# Altium schematic sheet 001_NUCLEO.SchDoc
size A4; SheetNumber: 2; SheetTotal: 3; SPICEModelCacheIXEBBHUF: <root> / <DocumentId>IXEBBHUF</DocumentId> / <CacheFrame Number="0"> / <Model Name="0603_150060rs75003" Kind="CKT"> / <Text>****** / .subckt 0603_150060RS75003  1  2 / D1 1 2 SMCW / .MODEL SMCW D / + IS=1.0025E-15 / + N=2.2259 / + RS=.3926 / + IKF=240.91E-6 / + CJO=1.0000E-12 / + M=.3333 / + VJ=.75 / + BV=5 / + IBV=10.00E-6 / + TT=5.0000E-9 / .ends</Text> / </Model> / </CacheFrame> / </root>
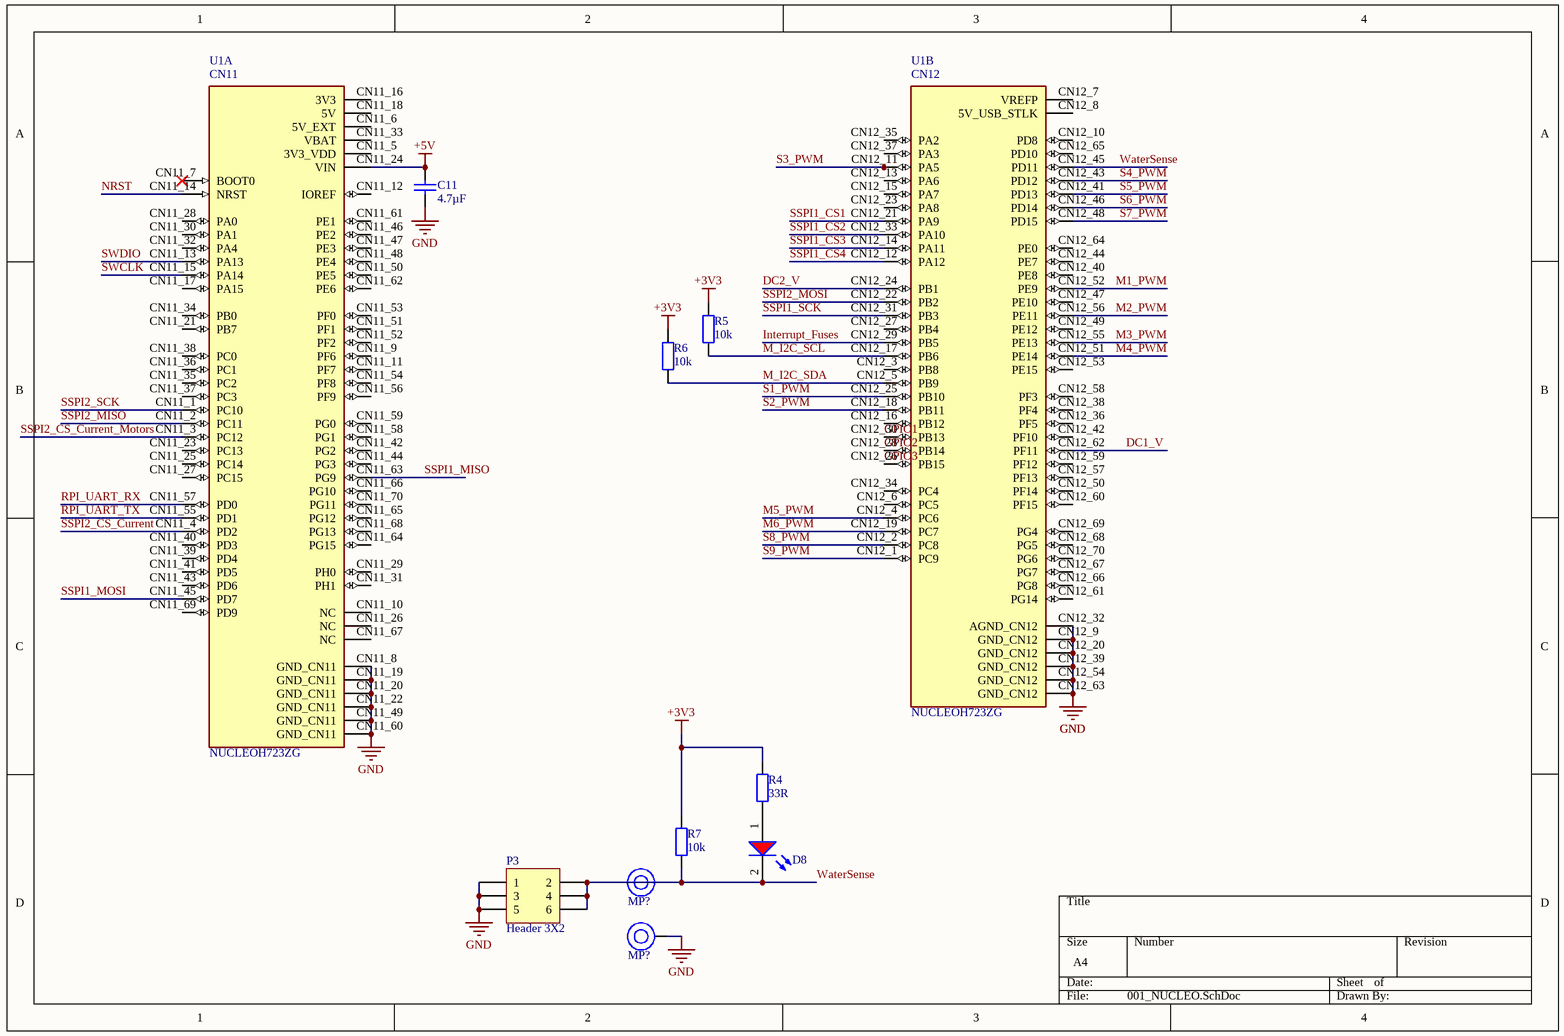
[diagram p0: 001_NUCLEO.SchDoc]

## Parts
(Parts that share a designator on the sheet are numbered #1, #2 ... from top to bottom, then left to right.)
C11  4.7µF  [WCAP-CSGP_1210_L3.2W2.5H2.5]
D8  Red, 2V, 140°  [WL-SMCW_0603_150060xx75003]  (value not drawn)
MP?#1  M3 x 3.6mm  [9775036360]  (value not drawn)  (graphical)
MP?#2  M3 x 3.6mm  [9775036360]  (value not drawn)  (graphical)
P3  Header 3X2  [HDR2X3]
R4  33R  [6-0805_M]
R5  10k  [6-0805_M]
R6  10k  [6-0805_M]
R7  10k  [6-0805_M]
U1  NUCLEOH723ZG  [MODULE_NUCLEOH723ZG]  (parts A,B of 10)

## Nets
+3V3: R4.2 R5.2 R6.2 R7.2
+5V: C11.2 U1.CN11_24(VIN)
GND: C11.1 MP?#2.1 P3.1 P3.3 P3.5 U1.CN11_8(GND_CN11) U1.CN11_19(GND_CN11) U1.CN11_20(GND_CN11) U1.CN11_22(GND_CN11) U1.CN11_49(GND_CN11) U1.CN11_60(GND_CN11) U1.CN12_9(GND_CN12) U1.CN12_20(GND_CN12) U1.CN12_32(AGND_CN12) U1.CN12_39(GND_CN12) U1.CN12_54(GND_CN12) U1.CN12_63(GND_CN12)
DC1_V: U1.CN12_62(PF11)
DC2_V: U1.CN12_24(PB1)
GPIO1: U1.CN12_30(PB13)
GPIO2: U1.CN12_28(PB14)
GPIO3: U1.CN12_26(PB15)
Interrupt_Fuses: U1.CN12_29(PB5)
M1_PWM: U1.CN12_52(PE9)
M2_PWM: U1.CN12_56(PE11)
M3_PWM: U1.CN12_55(PE13)
M4_PWM: U1.CN12_51(PE14)
M5_PWM: U1.CN12_4(PC6)
M6_PWM: U1.CN12_19(PC7)
M_I2C_SCL: R5.1 U1.CN12_17(PB6)
M_I2C_SDA: R6.1 U1.CN12_5(PB9)
NRST: U1.CN11_14(NRST)
RPI_UART_RX: U1.CN11_57(PD0)
RPI_UART_TX: U1.CN11_55(PD1)
S1_PWM: U1.CN12_25(PB10)
S2_PWM: U1.CN12_18(PB11)
S3_PWM: U1.CN12_11(PA5)
S4_PWM: U1.CN12_43(PD12)
S5_PWM: U1.CN12_41(PD13)
S6_PWM: U1.CN12_46(PD14)
S7_PWM: U1.CN12_48(PD15)
S8_PWM: U1.CN12_2(PC8)
S9_PWM: U1.CN12_1(PC9)
SSPI1_CS1: U1.CN12_21(PA9)
SSPI1_CS2: U1.CN12_33(PA10)
SSPI1_CS3: U1.CN12_14(PA11)
SSPI1_CS4: U1.CN12_12(PA12)
SSPI1_MISO: U1.CN11_63(PG9)
SSPI1_MOSI: U1.CN11_45(PD7)
SSPI1_SCK: U1.CN12_31(PB3)
SSPI2_CS_Current: U1.CN11_4(PD2)
SSPI2_CS_Current_Motors: U1.CN11_3(PC12)
SSPI2_MISO: U1.CN11_2(PC11)
SSPI2_MOSI: U1.CN12_22(PB2)
SSPI2_SCK: U1.CN11_1(PC10)
SWCLK: U1.CN11_15(PA14)
SWDIO: U1.CN11_13(PA13)
WaterSense: D8.2(K) MP?#1.1 P3.2 P3.4 P3.6 R7.1 U1.CN12_45(PD11)
NetD8_1: D8.1(A) R4.1

Not connected (* = marked no-connect by the designer): U1 CN11_5(3V3_VDD) CN11_6(5V_EXT) CN11_7(BOOT0)* CN11_9(PF6) CN11_10(NC) CN11_11(PF7) CN11_12(IOREF) CN11_16(3V3) CN11_17(PA15) CN11_18(5V) CN11_21(PB7) CN11_23(PC13) CN11_25(PC14) CN11_26(NC) CN11_27(PC15) CN11_28(PA0) CN11_29(PH0) CN11_30(PA1) CN11_31(PH1) CN11_32(PA4) CN11_33(VBAT) CN11_34(PB0) CN11_35(PC2) CN11_36(PC1) CN11_37(PC3) CN11_38(PC0) CN11_39(PD4) CN11_40(PD3) CN11_41(PD5) CN11_42(PG2) CN11_43(PD6) CN11_44(PG3) CN11_46(PE2) CN11_47(PE3) CN11_48(PE4) CN11_50(PE5) CN11_51(PF1) CN11_52(PF2) CN11_53(PF0) CN11_54(PF8) CN11_56(PF9) CN11_58(PG1) CN11_59(PG0) CN11_61(PE1) CN11_62(PE6) CN11_64(PG15) CN11_65(PG12) CN11_66(PG10) CN11_67(NC) CN11_68(PG13) CN11_69(PD9) CN11_70(PG11) CN12_3(PB8) CN12_6(PC5) CN12_7(VREFP) CN12_8(5V_USB_STLK) CN12_10(PD8) CN12_13(PA6) CN12_15(PA7) CN12_16(PB12) CN12_23(PA8) CN12_27(PB4) CN12_34(PC4) CN12_35(PA2) CN12_36(PF5) CN12_37(PA3) CN12_38(PF4) CN12_40(PE8) CN12_42(PF10) CN12_44(PE7) CN12_47(PE10) CN12_49(PE12) CN12_50(PF14) CN12_53(PE15) CN12_57(PF13) CN12_58(PF3) CN12_59(PF12) CN12_60(PF15) CN12_61(PG14) CN12_64(PE0) CN12_65(PD10) CN12_66(PG8) CN12_67(PG7) CN12_68(PG5) CN12_69(PG4) CN12_70(PG6)

## Notes on the sheet
- (in symbol NUCLEOH723ZG, part A) CN11
- (in symbol NUCLEOH723ZG, part B) CN12

## Library data of the parts
C11 = 885012209048: WCAP-CSGP Multilayer Ceramic Chip Capacitor, General Purpose, size 1210, X7R, 4.7µF, 50VDC; Manufacturer: Wurth Elektronik; Case/Size Code: 1210; Capacitance Tolerance: +/-10%; Dissipation Factor: 5%; Insulation Resistance: 0.02GΩ; Rated Voltage (DC): 50V; Technical Reference: X7R1210475K050DFCT10000; Manufacturer Part Number: 885012209048; Category: Multilayer Ceramic Chip Capacitors; Match Code: WCAP-CSGP; ComponentLink1Description: Website Link; ComponentLink1URL: https://www.we-online.com/redexpert/article/885012209048?ad; ComponentLink2Description: Datasheet Link; ComponentLink2URL: https://www.we-online.com/redexpert/spec/885012209048?ad; Mount: Surface Mount; Operating Temperature Max: 125°C; Operating Temperature Min: -55°C; Packaging: Tape and Reel; Length: 3.2mm; Width: 2.5mm; Height: 2.5mm; Capacitance: 4.7µF; Ceramic Type: X7R
D8 = 150060RS75003: WL-SMCW Mono-color Chip LED Waterclear, size 0603, Red, 2V, 140°; Manufacturer: Wurth Elektronik; Case/Size Code: 0603; Chip Technology: AlInGaP; Dominant Wavelength: 625nm; Luminous Intensity: 530mcd; Peak Wavelength: 630nm; Manufacturer Part Number: 150060RS75003; Category: Signal LEDs; Match Code: WL-SMCW; ComponentLink1Description: Website Link; ComponentLink1URL: https://www.we-online.com/redexpert/article/150060RS75003?ad; ComponentLink2Description: Datasheet Link; ComponentLink2URL: https://www.we-online.com/redexpert/spec/150060RS75003?ad; Mount: Surface Mount; Operating Temperature Max: 100°C; Operating Temperature Min: -40°C; Packaging: Tape and Reel; Length: 1.6mm; Width: 0.8mm; Height: 0.7mm; Emitting Color: Red; Forward Voltage: 2V; Viewing Angle: 140°
MP?#1 MP?#2 = 9775036360: WA-SMSR SMT Steel Spacer Reverse, M3 x 3.6mm; Manufacturer: Wurth Elektronik; Inside Diameter: 4.2mm; Outside Diameter: 6mm; Surface: Tin; ComponentLink1Description: Website Link; ComponentLink1URL: https://www.we-online.com/redexpert/article/9775036360?ad; ComponentLink2Description: Datasheet Link; ComponentLink2URL: https://www.we-online.com/redexpert/spec/9775036360?ad; Manufacturer Part Number: 9775036360; Category: SMT Spacers; Match Code: WA-SMSR; Mount: Surface Mount; Operating Temperature Max: 150°C; Operating Temperature Min: -55°C; Packaging: Bulk; Material: Steel; Pin Length: 3.6mm; Thread Size: M3
P3 = Header 3X2: Header, 3-Pin, Dual row; LatestRevisionDate: 17-Jul-2002; LatestRevisionNote: Re-released for DXP Platform.; Publisher: Altium Limited
R4-R7 = Res2: Resistor; Published: 8-Jun-2000; LatestRevisionDate: 17-Jul-2002; LatestRevisionNote: Re-released for DXP Platform.; PackageReference: AXIAL-0.4; Publisher: Altium Limited; PackageDescription: Axial Device, Thru-Hole; 2 Leads; 0.4 in Pin Spacing
  R4: Value: 33R
  R5-R7: Value: 10k
U1 = NUCLEOH723ZG: STM32H723ZG Nucleo-144 STM32H7 STM32 MCU 32-Bit Embedded Evaluation Board; MF: STMicroelectronics; Value: *; Purchase-URL: https://pricing.snapeda.com/search/part/NUCLEOH723ZG/?ref=eda; Package: None; Check_prices: https://www.snapeda.com/parts/NUCLEOH723ZG/STMicroelectronics/view-part/?ref=eda; MP: NUCLEOH723ZG; Price: None; SnapEDA_Link: https://www.snapeda.com/parts/NUCLEOH723ZG/STMicroelectronics/view-part/?ref=snap; Availability: In Stock